# EAGLE design Adafruit-Music-Maker-MP3-Shield-RevE (EAGLE 9.6.2)
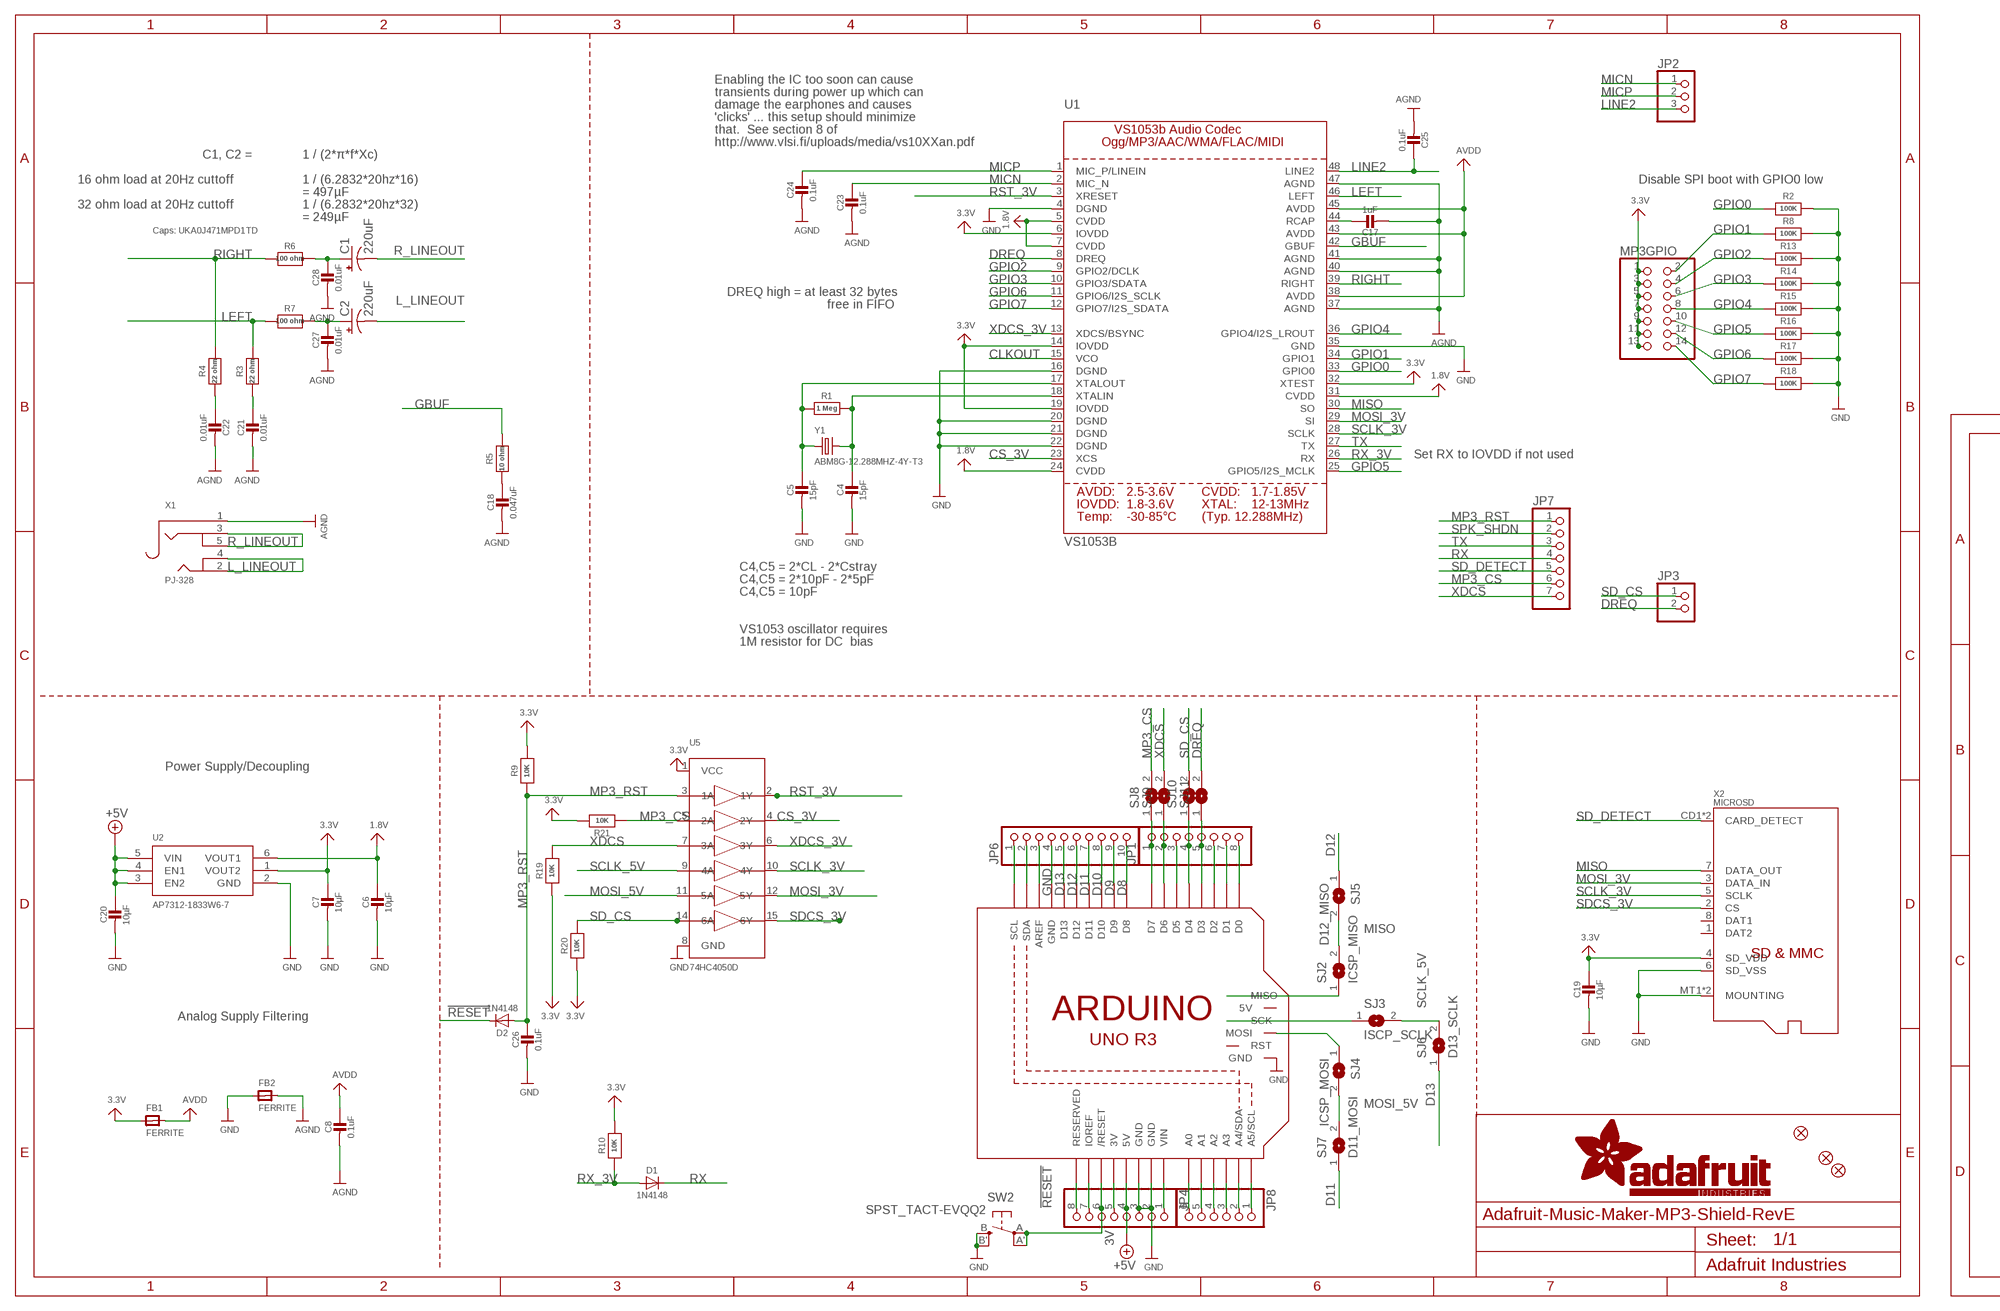
[diagram p0: schematic, sheet 1, part 1 of 2]
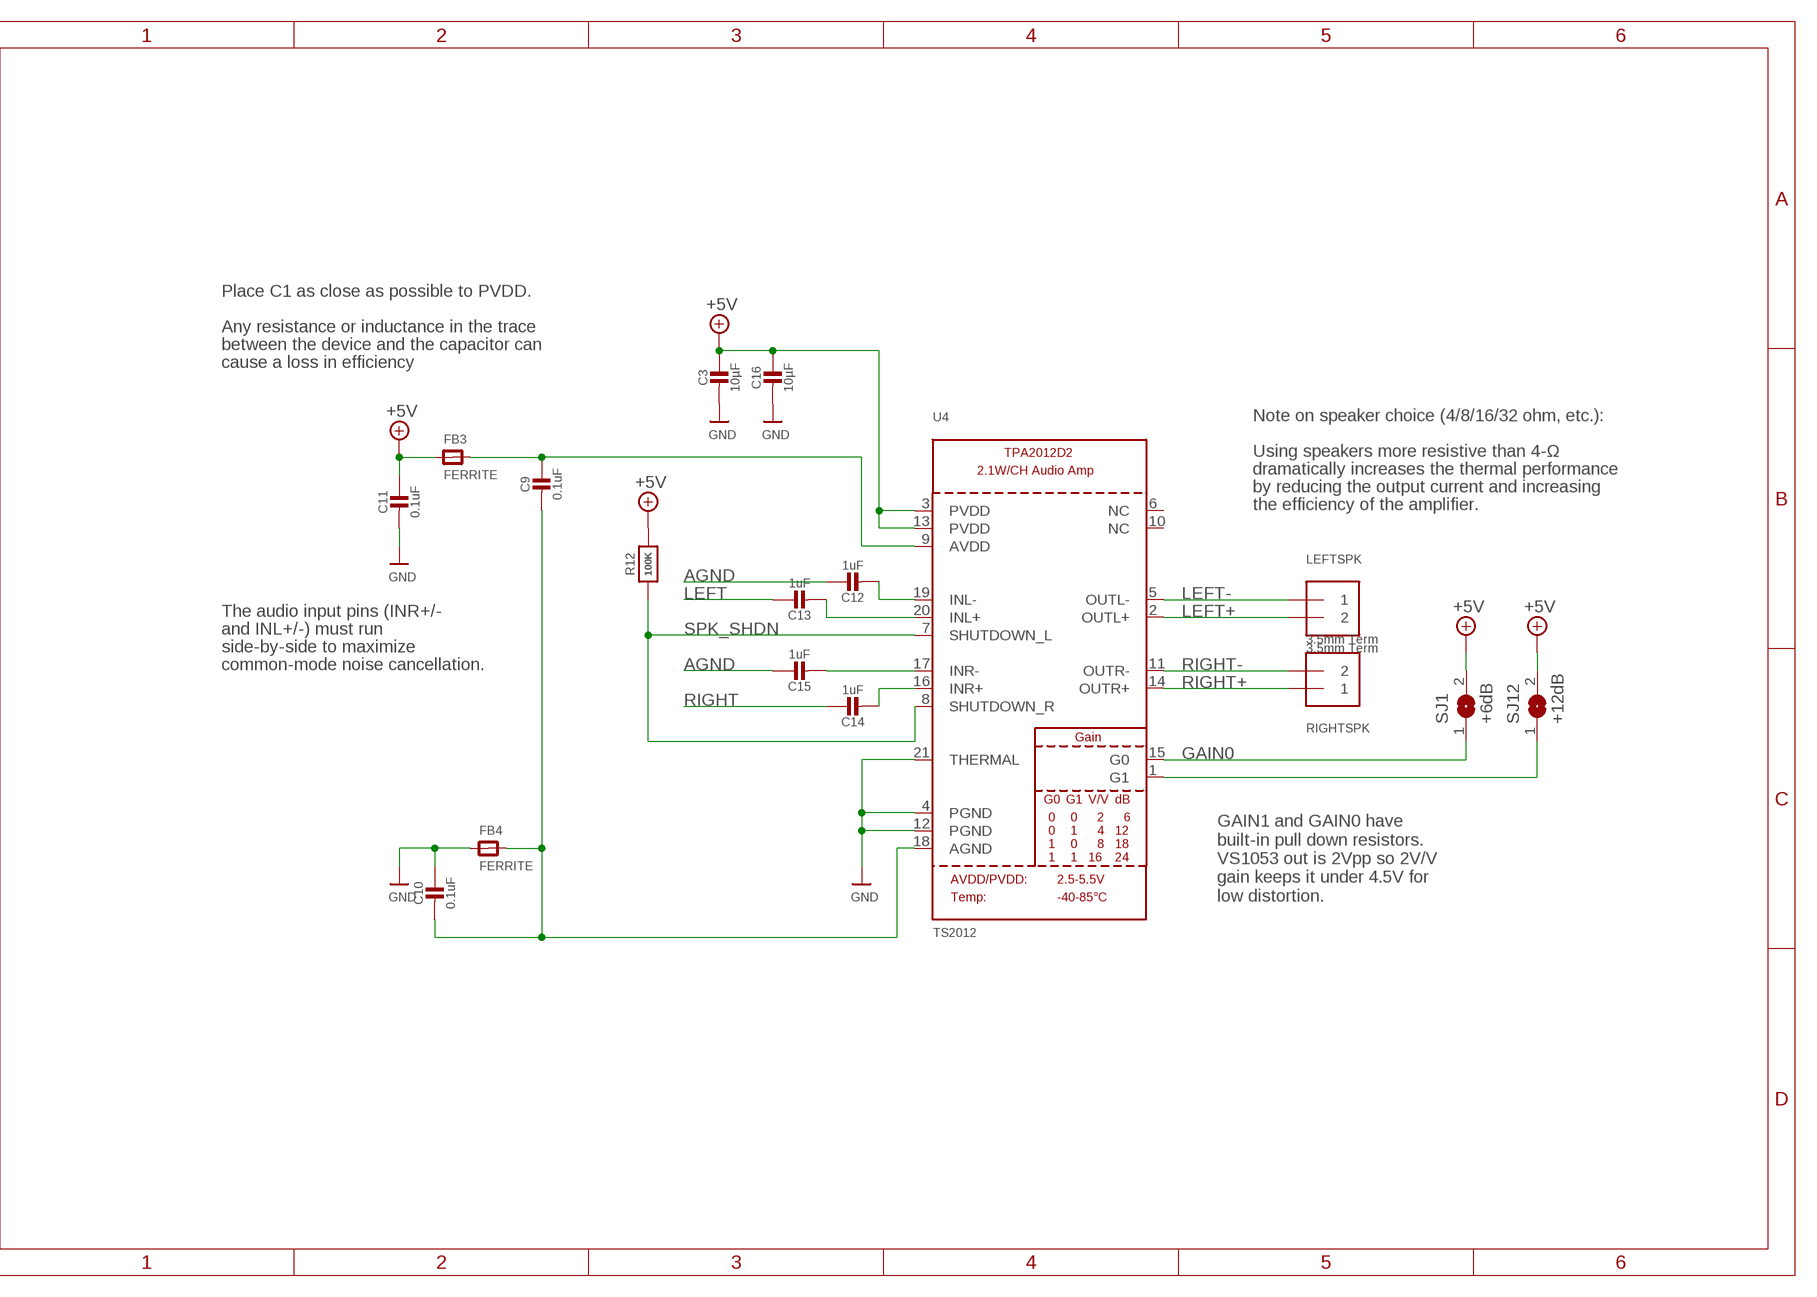
[diagram p1: schematic, sheet 1, part 2 of 2]

## Parts
C1  220uF  CPOL-USC  [PANASONIC_C]
C2  220uF  CPOL-USC  [PANASONIC_C]
C3  10µF  CAP_CERAMIC0805-NOOUTLINE  [0805-NO]
C4  15pF  CAP_CERAMIC0603_NO  [0603-NO]
C5  15pF  CAP_CERAMIC0603_NO  [0603-NO]
C6  10µF  CAP_CERAMIC0805-NOOUTLINE  [0805-NO]
C7  10µF  CAP_CERAMIC0805-NOOUTLINE  [0805-NO]
C8  0.1uF  CAP_CERAMIC0603_NO  [0603-NO]
C9  0.1uF  CAP_CERAMIC0603_NO  [0603-NO]
C10  0.1uF  CAP_CERAMIC0603_NO  [0603-NO]
C11  0.1uF  CAP_CERAMIC0603_NO  [0603-NO]
C12  1uF  CAP_CERAMIC0603_NO  [0603-NO]
C13  1uF  CAP_CERAMIC0603_NO  [0603-NO]
C14  1uF  CAP_CERAMIC0603_NO  [0603-NO]
C15  1uF  CAP_CERAMIC0603_NO  [0603-NO]
C16  10µF  CAP_CERAMIC0805-NOOUTLINE  [0805-NO]
C17  1uF  CAP_CERAMIC0603_NO  [0603-NO]
C18  0.047uF  CAP_CERAMIC0603_NO  [0603-NO]
C19  10µF  CAP_CERAMIC0805-NOOUTLINE  [0805-NO]
C20  10µF  CAP_CERAMIC0805-NOOUTLINE  [0805-NO]
C21  0.01uF  CAP_CERAMIC0603_NO  [0603-NO]
C22  0.01uF  CAP_CERAMIC0603_NO  [0603-NO]
C23  0.1uF  CAP_CERAMIC0603_NO  [0603-NO]
C24  0.1uF  CAP_CERAMIC0603_NO  [0603-NO]
C25  0.1uF  CAP_CERAMIC0603_NO  [0603-NO]
C26  0.1uF  CAP_CERAMIC0603_NO  [0603-NO]
C27  0.01uF  CAP_CERAMIC0603_NO  [0603-NO]
C28  0.01uF  CAP_CERAMIC0603_NO  [0603-NO]
D1  1N4148  DIODESOD-323  [SOD-323]
D2  1N4148  DIODESOD-323  [SOD-323]
FB1  FERRITE  FERRITE-0603NO  [0603-NO]
FB2  FERRITE  FERRITE-0603NO  [0603-NO]
FB3  FERRITE  FERRITE-0603NO  [0603-NO]
FB4  FERRITE  FERRITE-0603NO  [0603-NO]
FID1  FIDUCIAL_1MM  [FIDUCIAL_1MM]
FID2  FIDUCIAL_1MM  [FIDUCIAL_1MM]
FID3  FIDUCIAL_1MM  [FIDUCIAL_1MM]
JP1  PINHD-1X8CLEANBIG  [1X08-CLEANBIG]
JP2  PINHD-1X3CB  [1X03-CLEANBIG]
JP3  HEADER-1X2ROUND  [1X02_ROUND]
JP4  PINHD-1X8CLEANBIG  [1X08-CLEANBIG]
JP6  HEADER-1X1070MIL  [1X10_ROUND70]
JP7  HEADER-1X770MIL  [1X07_ROUND_70]
JP8  PINHD-1X6CB  [1X06-CLEANBIG]
LEFTSPK  3.5mm Term  TERMBLOCK_1X2_3.5MM  [TERMBLOCK_1X2-3.5MM]
MP3GPIO  HEADER-2X7_ROUND_70MIL  [2X07_ROUND_70MIL]
R1  1 Meg  RESISTOR_0603_NOOUT  [0603-NO]
R2  100K  RESISTOR_0603_NOOUT  [0603-NO]
R3  22 ohm  RESISTOR_0603_NOOUT  [0603-NO]
R4  22 ohm  RESISTOR_0603_NOOUT  [0603-NO]
R5  10 ohm  RESISTOR_0603_NOOUT  [0603-NO]
R6  100 ohm  RESISTOR_0603_NOOUT  [0603-NO]
R7  100 ohm  RESISTOR_0603_NOOUT  [0603-NO]
R8  100K  RESISTOR_0603_NOOUT  [0603-NO]
R9  10K  RESISTOR_0603_NOOUT  [0603-NO]
R10  10K  RESISTOR_0603_NOOUT  [0603-NO]
R12  100K  RESISTOR_0603_NOOUT  [0603-NO]
R13  100K  RESISTOR_0603_NOOUT  [0603-NO]
R14  100K  RESISTOR_0603_NOOUT  [0603-NO]
R15  100K  RESISTOR_0603_NOOUT  [0603-NO]
R16  100K  RESISTOR_0603_NOOUT  [0603-NO]
R17  100K  RESISTOR_0603_NOOUT  [0603-NO]
R18  100K  RESISTOR_0603_NOOUT  [0603-NO]
R19  10K  RESISTOR_0603_NOOUT  [0603-NO]
R20  10K  RESISTOR_0603_NOOUT  [0603-NO]
R21  10K  RESISTOR_0603_NOOUT  [0603-NO]
RIGHTSPK  3.5mm Term  TERMBLOCK_1X2_3.5MM  [TERMBLOCK_1X2-3.5MM]
SJ1  +6dB  SOLDERJUMPER  [SOLDERJUMPER_ARROW_NOPASTE]
SJ2  ICSP_MISO  SOLDERJUMPERCLOSED  [SOLDERJUMPER_CLOSEDWIRE]
SJ3  ISCP_SCLK  SOLDERJUMPERCLOSED  [SOLDERJUMPER_CLOSEDWIRE]
SJ4  ICSP_MOSI  SOLDERJUMPERCLOSED  [SOLDERJUMPER_CLOSEDWIRE]
SJ5  D12_MISO  SOLDERJUMPER  [SOLDERJUMPER_ARROW_NOPASTE]
SJ6  D13_SCLK  SOLDERJUMPER  [SOLDERJUMPER_ARROW_NOPASTE]
SJ7  D11_MOSI  SOLDERJUMPER  [SOLDERJUMPER_ARROW_NOPASTE]
SJ8  SOLDERJUMPERCLOSED  [SOLDERJUMPER_CLOSEDWIRE]
SJ9  SOLDERJUMPERCLOSED  [SOLDERJUMPER_CLOSEDWIRE]
SJ10  SOLDERJUMPERCLOSED  [SOLDERJUMPER_CLOSEDWIRE]
SJ11  SOLDERJUMPERCLOSED  [SOLDERJUMPER_CLOSEDWIRE]
SJ12  +12dB  SOLDERJUMPER  [SOLDERJUMPER_ARROW_NOPASTE]
SW2  SPST_TACT-EVQQ2  [EVQ-Q2]
U1  VS1053B  [LQFP48]
U2  AP7312-1833W6-7  VREG_SOT23-6_DUALAP7312  [SOT23-6]
U4  TS2012  AUDIOAMP_TPA2012D2  [WQFN20]
U5  74HC4050D  [SOIC16]
U$41  ARDUINO_R3_ICSP  [ARDUINOR3_ICSP]
X1  PJ-328  AUDIO_3.5MMJACK  [PJ-328-5]
X2  MICROSD  [MICROSD]
Y1  ABM8G-12.288MHZ-4Y-T3  CRYSTAL3.2X2.5  [CRYSTAL_3.2X2.5]

## Nets
1.8V: C6.1 U1.5(CVDD) U1.7(CVDD) U1.24(CVDD) U1.31(CVDD) U2.6(VOUT1)
3.3V: C7.1 C19.1 FB1.1 MP3GPIO.1 MP3GPIO.3 MP3GPIO.5 MP3GPIO.7 MP3GPIO.9 MP3GPIO.11 MP3GPIO.13 R9.2 R10.2 R19.1 R20.1 R21.2 U1.6(IOVDD) U1.14(IOVDD) U1.19(IOVDD) U1.32(XTEST) U2.1(VOUT2) U5.1(VCC) X2.4(SD_VDD)
3V: JP4.5 U$41.3V
!RESET: D2.C JP4.6 SW2.A'(P1) SW2.A(P) U$41.RESET(/RESET)
+5V: C3.1 C11.1 C16.1 C20.1 FB3.1 JP4.4 R12.2 SJ1.2 SJ12.2 U2.3(EN2) U2.4(EN1) U2.5(VIN) U4.3(PVDD) U4.13(PVDD) U$41.5V
A0: JP8.6 U$41.A0
A1: JP8.5 U$41.A1
A2: JP8.4 U$41.A2
A3: JP8.3 U$41.A3
A4: JP8.2 U$41.A4(A4/SDA)
A5: JP8.1 U$41.A5(A5/SCL)
AGND: C8.2 C12.1 C15.1 C17.2 C18.2 C21.2 C22.2 C23.2 C24.2 C25.2 C27.2 C28.2 FB2.2 U1.37(AGND) U1.40(AGND) U1.41(AGND) U1.47(AGND) X1.1
AREF: JP6.3 U$41.AREF
AVDD: C8.1 FB1.2 U1.38(AVDD) U1.43(AVDD) U1.45(AVDD)
CLKOUT: U1.15(VCO)
CS_3V: U1.23(XCS) U5.4(2Y)
D0: JP1.8 U$41.D0
D1: JP1.7 U$41.D1
D2: JP1.6 U$41.D2
D3: JP1.5 SJ11.1 U$41.D3
D4: JP1.4 SJ10.1 U$41.D4
D5: JP1.3 U$41.D5
D6: JP1.2 SJ9.1 U$41.D6
D7: JP1.1 SJ8.1 U$41.D7
D8: JP6.10 U$41.D8
D9: JP6.9 U$41.D9
D10: JP6.8 U$41.D10
D11: JP6.7 SJ7.1 U$41.D11
D12: JP6.6 SJ5.1 U$41.D12
D13: JP6.5 SJ6.1 U$41.D13
DREQ: JP3.2 SJ11.2 U1.8(DREQ)
GAIN0: SJ1.1 U4.15(G0)
GBUF: R5.1 U1.42(GBUF)
GND: C3.2 C4.2 C5.2 C6.2 C7.2 C10.1 C11.2 C16.2 C19.2 C20.2 C26.2 FB2.1 FB4.1 JP4.2 JP4.3 JP6.4 R2.2 R8.2 R13.2 R14.2 R15.2 R16.2 R17.2 R18.2 SW2.B'(S1) SW2.B(S) U1.4(DGND) U1.16(DGND) U1.20(DGND) U1.21(DGND) U1.22(DGND) U1.35(GND) U2.2(GND) U4.4(PGND) U4.12(PGND) U4.21(THERMAL) U5.8(GND) U$41.GND U$41.GND@1(GND) U$41.GND@2(GND) U$41.GND@3(GND) X2.6(SD_VSS) X2.MT1(MOUNTING) X2.MT2(MOUNTING)
GPIO0: R2.1 U1.33(GPIO0)
GPIO1: MP3GPIO.2 R8.1 U1.34(GPIO1)
GPIO2: MP3GPIO.4 R13.1 U1.9(GPIO2/DCLK)
GPIO3: MP3GPIO.6 R14.1 U1.10(GPIO3/SDATA)
GPIO4: MP3GPIO.8 R15.1 U1.36(GPIO4/I2S_LROUT)
GPIO5: MP3GPIO.10 R16.1 U1.25(GPIO5/I2S_MCLK)
GPIO6: MP3GPIO.12 R17.1 U1.11(GPIO6/I2S_SCLK)
GPIO7: MP3GPIO.14 R18.1 U1.12(GPIO7/I2S_SDATA)
IOREF: JP4.7 U$41.IOREF
L_LINEOUT: C2.- X1.2 X1.4
LEFT: C13.1 R3.1 R7.2 U1.46(LEFT)
LEFT+: LEFTSPK.2 U4.2(OUTL+)
LEFT-: LEFTSPK.1 U4.5(OUTL-)
LEFT_FILTERED: C2.+ C27.1 R7.1
LINE2: C25.1 JP2.3 U1.48(LINE2)
MICN: C23.1 JP2.1 U1.2(MIC_N)
MICP: C24.1 JP2.2 U1.1(MIC_P/LINEIN)
MISO: SJ2.2 SJ5.2 U1.30(SO) X2.7(DATA_OUT)
MISO_ICSP: SJ2.1 U$41.MISO
MOSI_3V: U1.29(SI) U5.12(5Y) X2.3(DATA_IN)
MOSI_5V: SJ4.2 SJ7.2 U5.11(5A)
MOSI_ICSP: SJ4.1 U$41.MOSI
MP3_CS: JP7.6 R21.1 SJ8.2 U5.5(2A)
MP3_RST: C26.1 D2.A JP7.1 R9.1 U5.3(1A)
N$1: C5.1 R1.1 U1.17(XTALOUT) Y1.1
N$2: C4.1 R1.2 U1.18(XTALIN) Y1.2
N$5: C21.1 R3.2
N$6: C22.1 R4.2
N$8: C13.2 U4.20(INL+)
N$9: C12.2 U4.19(INL-)
N$10: C15.2 U4.17(INR-)
N$11: C14.2 U4.16(INR+)
N$12: C9.2 C10.2 FB4.2 U4.18(AGND)
N$14: C9.1 FB3.2 U4.9(AVDD)
N$26: SJ12.1 U4.1(G1)
N$27: C17.1 U1.44(RCAP)
N$31: C18.1 R5.2
NC: JP4.8 U$41.RESERVED
R_LINEOUT: C1.- X1.3 X1.5
RIGHT: C14.1 R4.1 R6.2 U1.39(RIGHT)
RIGHT+: RIGHTSPK.1 U4.14(OUTR+)
RIGHT-: RIGHTSPK.2 U4.11(OUTR-)
RIGHT_FILTERED: C1.+ C28.1 R6.1
RST_3V: U1.3(XRESET) U5.2(1Y)
RX: D1.C JP7.4
RX_3V: D1.A R10.1 U1.26(RX)
SCK_ICSP: SJ3.1 U$41.SCK
SCL: JP6.1 U$41.SCL
SCLK_3V: U1.28(SCLK) U5.10(4Y) X2.5(SCLK)
SCLK_5V: SJ3.2 SJ6.2 U5.9(4A)
SD_CS: JP3.1 R20.2 SJ10.2 U5.14(6A)
SD_DETECT: JP7.5 X2.CD1(CARD_DETECT) X2.CD2(CARD_DETECT)
SDA: JP6.2 U$41.SDA
SDCS_3V: U5.15(6Y) X2.2(CS)
SPK_SHDN: JP7.2 R12.1 U4.7(SHUTDOWN_L) U4.8(SHUTDOWN_R)
TX: JP7.3 U1.27(TX)
VIN: JP4.1 U$41.VIN
XDCS: JP7.7 R19.2 SJ9.2 U5.7(3A)
XDCS_3V: U1.13(XDCS/BSYNC) U5.6(3Y)
Unconnected: U4.6(NC) U4.10(NC) U$41.5V_ICSP(5V) U$41.RESET_ICSP(RST) X2.1(DAT2) X2.8(DAT1)

## Notes on the sheet
- Enabling the IC too soon can cause
- transients during power up which can
- damage the earphones and causes
- 'clicks' ... this setup should minimize
- that.  See section 8 of
- http://www.vlsi.fi/uploads/media/vs10XXan.pdf
- C1, C2 = | 1 / (2*π*f*Xc)
- 16 ohm load at 20Hz cuttoff | 1 / (6.2832*20hz*16) | Disable SPI boot with GPIO0 low
- = 497µF
- 32 ohm load at 20Hz cuttoff | 1 / (6.2832*20hz*32)
- = 249µF
- Caps: UKA0J471MPD1TD
- DREQ high = at least 32 bytes
- free in FIFO
- Set RX to IOVDD if not used
- C4,C5 = 2*CL - 2*Cstray
- C4,C5 = 2*10pF - 2*5pF
- C4,C5 = 10pF
- Place C1 as close as possible to PVDD.
- VS1053 oscillator requires | Any resistance or inductance in the trace
- 1M resistor for DC  bias | between the device and the capacitor can
- cause a loss in efficiency
- Note on speaker choice (4/8/16/32 ohm, etc.):
- Using speakers more resistive than 4-Ω
- dramatically increases the thermal performance
- by reducing the output current and increasing
- the efficiency of the amplifier.
- Power Supply/Decoupling
- The audio input pins (INR+/-
- and INL+/-) must run
- side-by-side to maximize
- common-mode noise cancellation.
- Analog Supply Filtering
- GAIN1 and GAIN0 have
  built-in pull down resistors.
  VS1053 out is 2Vpp so 2V/V
  gain keeps it under 4.5V for
  low distortion.

## Library data of the parts
C1 C2 = rcl:CPOL-US: POLARIZED CAPACITOR, American symbol; SPICEPREFIX: C
C3-C28 = microbuilder:CAP_CERAMIC: Ceramic Capacitors For new designs, use the packages preceded by an '_' character since they are more reliable: The following footprints should be used on most boards: _0402 - Standard footprint for regular board layouts _0603 - Standard footprint for regular board layouts _0805 - Standard footprint for regular board layouts _1206 - Standard footprint for regular board layouts For extremely tight-pitch boards where space is at a premium, the following 'micro-pitch' footprints can be used (smaller pads, no silkscreen outline, etc.): _0402MP - Micro-pitch footprint for very dense/compact boards _0603MP - Micro-pitch footprint for very dense/compact boards _0805MP - Micro-pitch footprint for very dense/compact boards _1206MP - Micro-pitch footprint for very dense/compact boards
D1 D2 = microbuilder:DIODE: Diode SMA Model Volts Amps Type Vf Ir Digikey # Notes SSA34-E3 40V 3A Schottky 480mV @ 3A 200uA @ 40V SSA34-E3/61TGITR-ND CDBA120-G 20V 1A Schottky 500mV @ 1A 500uA @ 20V 641-1014-6-ND REEL MBRA210 10V 2A Schottky 350mV @ 2A 700uA @ 10V MBRA210LT3 SOD-123 Model Volts Amps Type Vf Ir Order # Notes BAT54T1G 30V 200mA Schottky 800mV @ 200mA 2uA @ 25V BAT54T1GOSTR-ND B0530W 30V 500mA Schottky 430mV @ 500mA 130uA @ 30V B0530W-FDICT-ND REEL MBR120 20V 1A Schottky 340mV @ 1A MBR120VLSFT1GOSCT-ND SOD-323 Model Volts Amps Type Vf Ir Order # Notes PMEG2005EJ 20V 500mA Schottky 355mV @ 500mA 568-4110-1-ND ZLLS410 10V 570mA Schottky 380mV @ 570mA ZLLS410CT-ND 1N4148WS 75V 150mA Silicon/Simple 1V 1N4148WSFSCT-ND REEL SOD-523 Model Volts Amps Type Vf Ir Order # Notes BAT54XV2 30V 200mA Schottky 0.8V @ 100mA BAT54XV2CT-ND TB751S 30V 30mA Schottky RB751S-40TE61CT-ND SOT23-R/W (R = Solder Paste/Reflow Ovens, W = Hand-Soldering) Model Volts Amps Type Vf Ir Order # Notes BAT54FILM 40V 300mA Schottky 497-7162-1-ND POWERDI-5 Model Volts Amps Type Vf Ir Order # Notes PDS560 60V 5A Schottky 670mV @ 5A 150uA @ 60V PDS560DICT-ND
FB1-FB4 = microbuilder:FERRITE: Ferrite Bead 0603 MMZ1608B121C - 120 Ohm @ 100MHz, 600mA, 0.15 Ohm DC Resistance - Digikey: 445-2164-1-ND BK1608HW121-T - 120 Ohm, 600mA Ferrite Chip - Digikey: 587-1876-2-ND 0805 HZ0805B272R-10 - 2.7K Ohm @ 100MHz, 200mA, 0.8 Ohm DC Resistance - Digikey: 240-2504-1-ND (see also Murata BLM21BD272SN1L) MMZ2012Y152B - 1.5K Ohm @ 100MHz, 500mA, 0.4 Ohm DC Resistance - Digikey: 445-1560-1-ND - Mainly for high frequency (80-400MHz) MMZ2012R102A - 1K Ohm @ 100MHz, 500mA, 0.3 Ohm DC Resistance - Digikey: 445-1555-2-ND - More general purpose (10-200MHz)
FID1-FID3 = microbuilder:FIDUCIAL: Fiducial Alignment Points Various fiducial points for machine vision alignment.; BOM: EXCLUDE
JP1 JP4 = adafruit:PINHD-1X8: PIN HEADER
JP2 = adafruit:PINHD-1X3: PIN HEADER
JP3 = microbuilder:HEADER-1X2: PIN HEADER
JP6 = microbuilder:HEADER-1X10: PIN HEADER
JP7 = microbuilder:HEADER-1X7: PIN HEADER
JP8 = adafruit:PINHD-1X6: PIN HEADER
LEFTSPK RIGHTSPK = adafruit_electromech:TERMBLOCK_1X2: 3.5mm Terminal block http://www.ladyada.net/library/pcb/eaglelibrary.html
MP3GPIO = microbuilder:HEADER-2X7: PIN HEADER
R1-R10 R12-R21 = microbuilder:RESISTOR: Resistors For new designs, use the packages preceded by an '_' character since they are more reliable: The following footprints should be used on most boards: _0402 - Standard footprint for regular board layouts _0603 - Standard footprint for regular board layouts _0805 - Standard footprint for regular board layouts _1206 - Standard footprint for regular board layouts For extremely tight-pitch boards where space is at a premium, the following 'micro-pitch' footprints can be used (smaller pads, no silkscreen outline, etc.): _0402MP - Micro-pitch footprint for very dense/compact boards _0603MP - Micro-pitch footprint for very dense/compact boards _0805MP - Micro-pitch footprint for very dense/compact boards _1206MP - Micro-pitch footprint for very dense/compact boards
SJ1 SJ5-SJ7 SJ12 = microbuilder:SOLDERJUMPER: SMD Solder JUMPER Solder the two pads together to create a connection, or remove the solder to break it. REFLOW - Use this footprint for solder paste and reflow ovens. WAVE - Use this footprint for hand-soldering (larger pads). CLOSED - Has a trace between the two pads to ensure it is closed by default. The trace needs to be cut to disable the jumper, and can be closed again by creating a solder bridge between the two pads.; BOM: EXCLUDE
SJ2-SJ4 SJ8-SJ11 = microbuilder:SOLDERJUMPER: SMD Solder JUMPER Solder the two pads together to create a connection, or remove the solder to break it. REFLOW - Use this footprint for solder paste and reflow ovens. WAVE - Use this footprint for hand-soldering (larger pads). CLOSED - Has a trace between the two pads to ensure it is closed by default. The trace needs to be cut to disable the jumper, and can be closed again by creating a solder bridge between the two pads.
SW2 = adafruit:SPST_TACT: SMT 6mm switch, EVQQ2 series http://www.ladyada.net/library/eagle
U1 = microbuilder:VS1053B: VS1053b Audio Codec - Ogg Vorbis/MP3/AAC/WMA/FLAC/MIDI; ROT: 270
U2 = adafruit_power:VREG_SOT23-6_DUAL: Dual Output SOT23-6 Linear Regulators Diodes Inc. AP7312 - Dual 150mA LDO Linear Regulator 0.2V dropout, 150mA output, 2-6V Input AP7312-1833W6-7 - 1.8V/3.3V SOT23-6 (Digikey: AP7312-1833W6-7DICT-ND) MIC5320 - Dual 150mA ULDO Linear Regulator Ultra-low 35mV dropout at 150mA, 2.3-5.5V Input 3.3V/1.8V SOT23-6 (Digikey: 576-1658-1-ND) 3.3V/1.5V SOT23-6 (Digikey: 576-3483-1-ND)
U4 = microbuilder:AUDIOAMP_TPA2012D2: TPA2012D2 2.1W/CH Stereo Class-D Audio Amp 2.1W/Ch into 4 Ohm at 5V 1.4W/Ch into 8 Ohm at 5V 720mW/Ch into 8 ohm at 3.6V Selectable Gain: 6, 12, 18 or 24 dB Power Supply (PVDD and AVDD): 2.5-5.5V Operating Temperature: -40 to 85°C Digikey (QFN20): 296-17692-1-ND; ROT: 90
U5 = microbuilder:74HC4050D: 6-channel level shifter 74HC4050D - 2V-6V Supply SOIC16 Digikey: 74HC4050D,653-ND Mouser: 771-74HC4050D-T TSSOP16 Digikey: 296-9215-1-ND Mouser:
U$41 = adafruit_micro:ARDUINO_R3_ICSP
X1 = adafruit_electromech:AUDIO_3.5MMJACK: 3.5MM Audio Jack These are normally connected as follows, from left-to right on the schematic symbol above: Tip: Left Audio Inner Ring: Right Audio Shell: Common/GND
X2 = adafruit_electromech:MICROSD: MicroSD/Transflash Card Holder with SPI pinout 3M: 2908-05WB-MG 4UConnector: 19656 Footprint courtesy: Adafruit Industries; JLC_ROTATION: 90; LCSC: C125617
Y1 = microbuilder:CRYSTAL: Crystals HC49UP - Surface Mount Crystal 4.0MHz 18pF +/-30ppm Surface Mount Crystal [Digikey: 535-9857-1-ND] 12.0 MHz Surface Mount Crystal [Digikey: 535-9869-6-ND] 25.0 MHz Surface Mount Crystal [Digikey: 535-9078-1-ND] 2.5 x 2.0mm - MEMs SMT Crystal 16.0 MHz 10pF 20ppm 2.5 x 2.0mm Crystal [Digikey -40-85°C: 535-10923-1-ND] 3.2 x 2.5mm - MEMs SMT Crystal 12.0 MHz 8pF 15ppm 3.2 x 2.5mm Crystal [Digikey: -10-70°C: 644-1047-1-ND -40-125°C: 644-1128-1-ND] 40~85°C cheaper: 644-1173-6-ND 16.0 MHz 8pF 15ppm 3.2 x 2.5mm Crystal [Digikey: -10-70°C: 644-1049-1-ND -40-125°C: 644-1129-2-ND]-40~85°C cheaper: 644-1175-6-ND 16.0 MHz 10pF 10ppm 3.2 x 2.5mm Crystal [Digikey: 644-1100-1-ND] 27.12 MHz 18pF 30ppm 3.2 x 2.5mm Crystal [Digikey: 887-1424-1-ND] 27.12MHz 10pF 10ppm 3.2 x 2.5mm Crystal [Digikey: 887-1329-1-ND] 4.9 x 1.8mm - MEMs SMT Crystal 32.768 KHz 12.5pF 20ppm 4.9 x 1.8mm Crystal [Digikey: SE2415CT-ND] 8.0 x 3.8mm - Surface Mount Crystal 32.768kHz 12.5pF 20ppm -40°C-85°C [Digikey: 535-9166-2-ND] Cylinder 32.768KHz Cylinder Crystal (2x6mm body) [Ex. Digikey: 300-8341-2-ND]

## Board
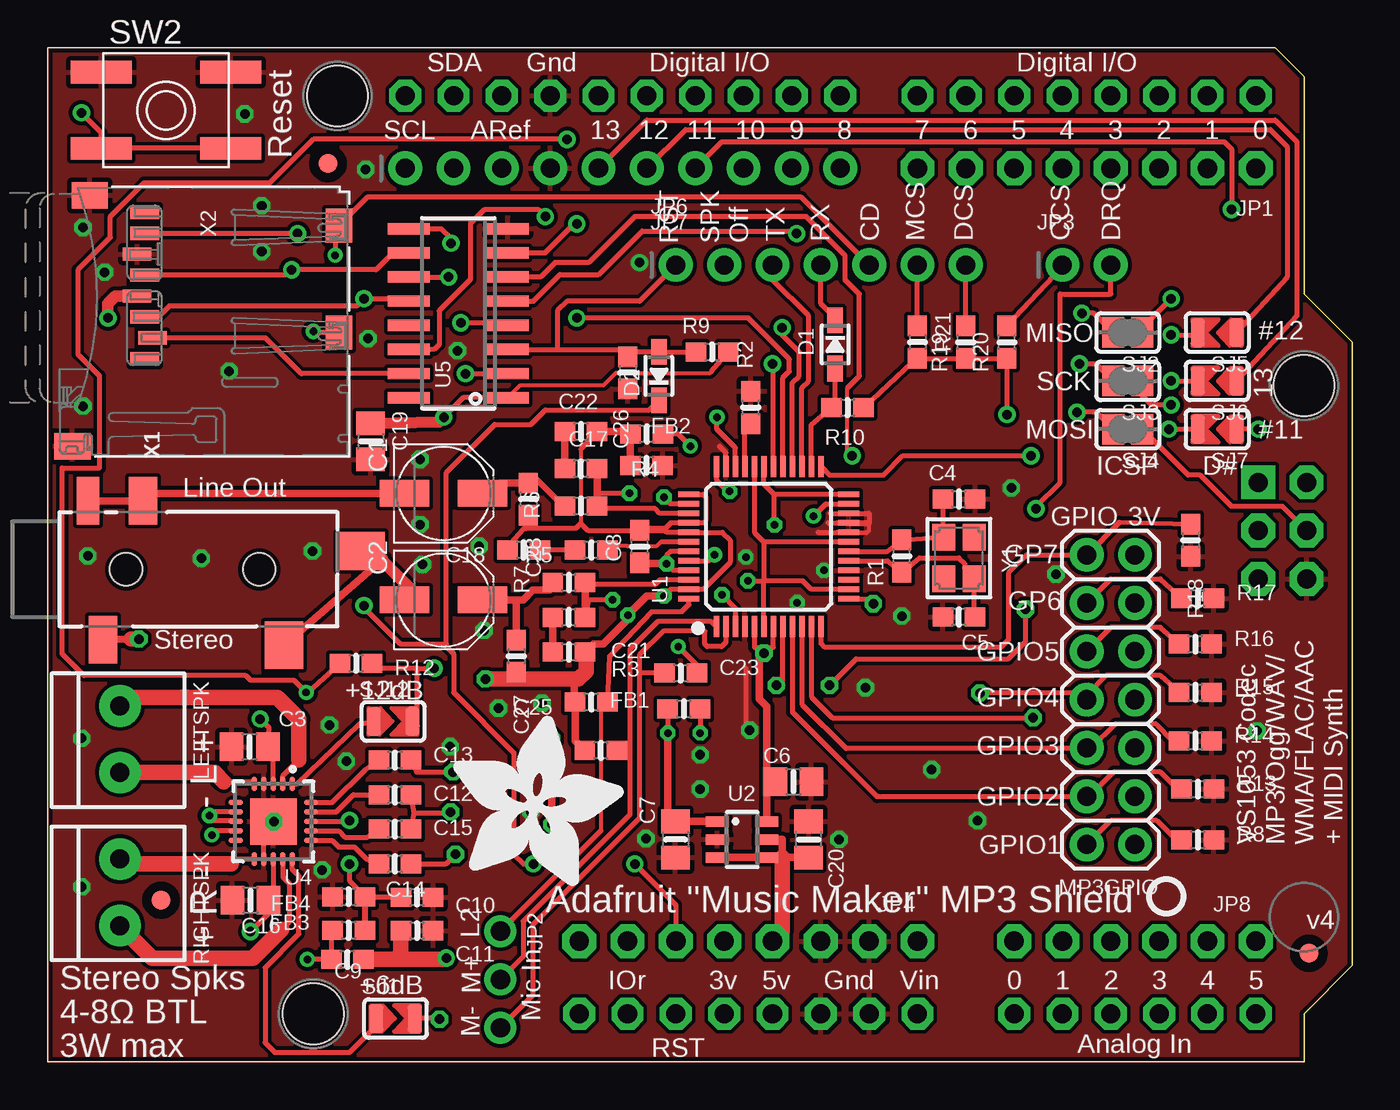
[diagram p2: board, top side]
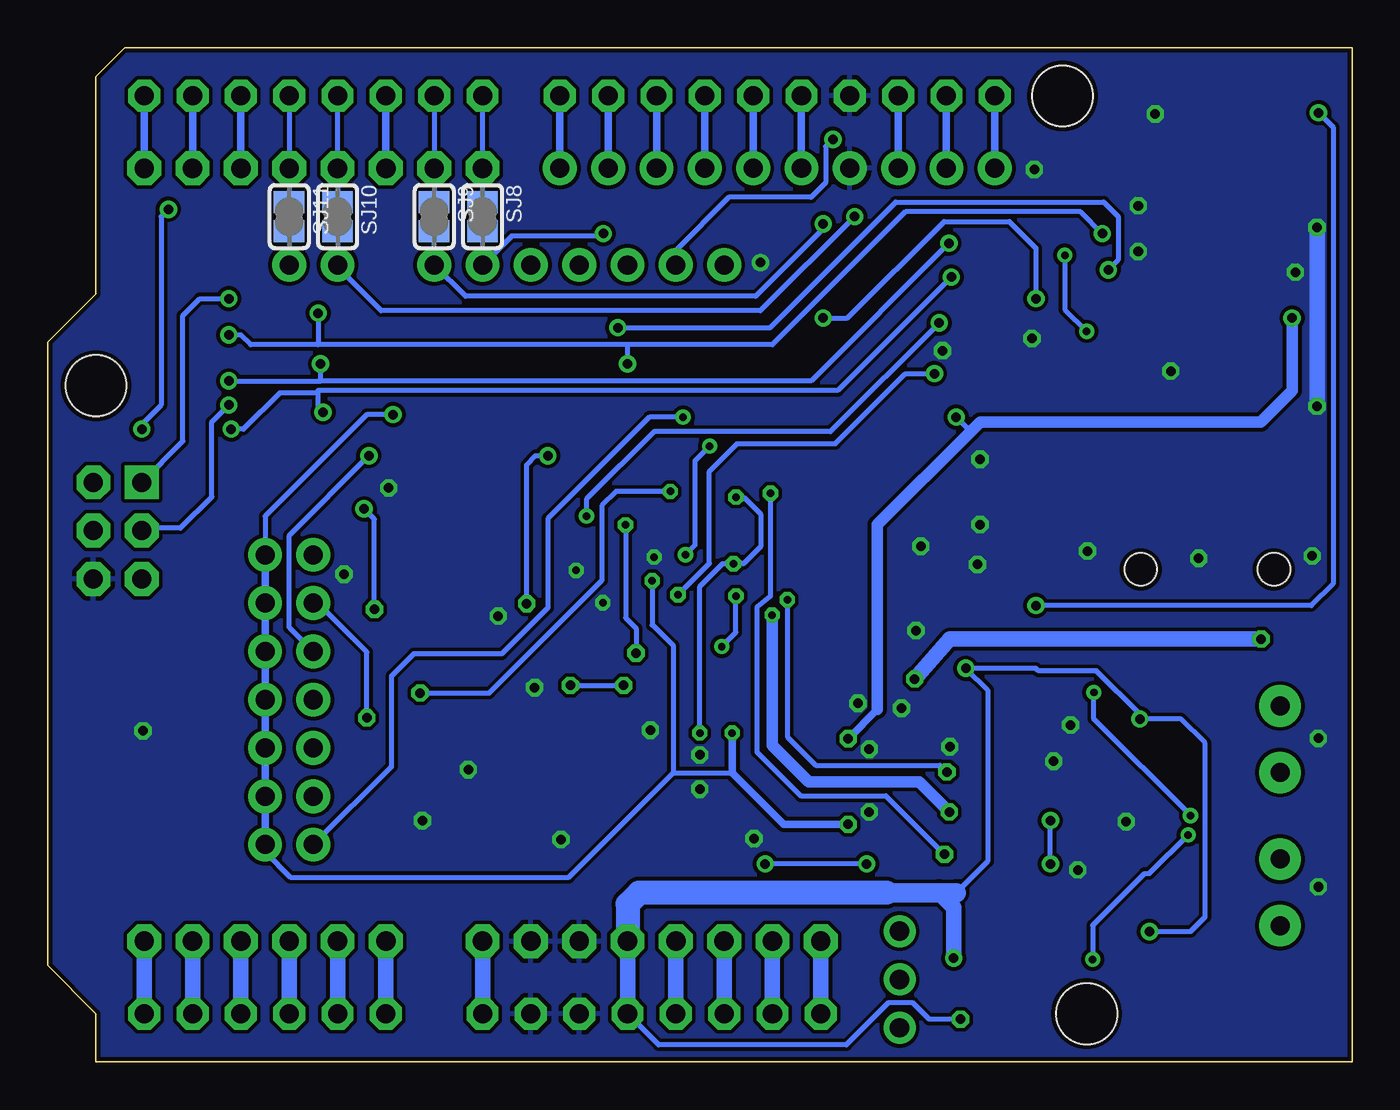
[diagram p3: board, bottom side, seen from below]

Size 68.58 x 53.34 mm. Coordinates in mm from the lower left corner, seen from the top.
Outline: 0,0 0,53.34 64.52,53.34 66.04,51.82 66.04,40.39 68.58,37.85 68.58,5.08 66.04,2.54 66.04,0 0,0
Copper layers (1*16): Top 0.035mm / dielectric 1.5mm / Bottom 0.035mm
Design rules "adafruit *": minimum track width 8mil, minimum drill 15.5mil, track to track 8mil, track to pad 8mil, pad to pad 8mil, via to via 8mil, smd to smd 8mil, copper to edge 10mil, drill to drill 8mil, minimum pad ring 10mil, minimum via ring 8mil, stop-mask expansion 2mil, vias tented up to drill 20mil, thermal gap 10mil
Holes 3.2 mm at 15.24,50.8 13.97,2.54 66.04,35.56
tRestrict: 3 lines

### Footprints (pad centres in the part's own frame; a part is rotated, then mirrored left to right if it is on the bottom)
PANASONIC_C = smd 2.6 x 1.4: + 2.05,0; - -2.05,0
0805-NO = smd 1.24 x 1.5: 1 -0.95,0; 2 0.95,0
0603-NO = smd 1.075 x 1: 1 -0.85,0; 2 0.85,0
SOD-323 = smd 1.35 x 0.8: A 1.27,0; C -1.27,0
FIDUCIAL_1MM = smd 1 x 1: 1 0,0
1X08-CLEANBIG = drill 1.016 pad 1.778 octagon: 1 -8.89,0; 2 -6.35,0; 3 -3.81,0; 4 -1.27,0; 5 1.27,0; 6 3.81,0; 7 6.35,0; 8 8.89,0
1X03-CLEANBIG = drill 1.016 pad 1.676: 1 -2.54,0; 2 0,0; 3 2.54,0
1X02_ROUND = drill 1 pad 1.778: 1 -1.27,0; 2 1.27,0
1X10_ROUND70 = drill 1 pad 1.778: 1 -11.43,0; 2 -8.89,0; 3 -6.35,0; 4 -3.81,0; 5 -1.27,0; 6 1.27,0; 7 3.81,0; 8 6.35,0; 9 8.89,0; 10 11.43,0
1X07_ROUND_70 = drill 1 pad 1.778: 1 -7.62,0; 2 -5.08,0; 3 -2.54,0; 4 0,0; 5 2.54,0; 6 5.08,0; 7 7.62,0
1X06-CLEANBIG = drill 1.016 pad 1.778 octagon: 1 -6.35,0; 2 -3.81,0; 3 -1.27,0; 4 1.27,0; 5 3.81,0; 6 6.35,0
TERMBLOCK_1X2-3.5MM = drill 1 pad 2.184: 1 1.8,0; 2 -1.7,0
2X07_ROUND_70MIL = drill 1 pad 1.778: 1 -7.62,-1.27; 2 -7.62,1.27; 3 -5.08,-1.27; 4 -5.08,1.27; 5 -2.54,-1.27; 6 -2.54,1.27; 7 0,-1.27; 8 0,1.27; 9 2.54,-1.27; 10 2.54,1.27; 11 5.08,-1.27; 12 5.08,1.27; 13 7.62,-1.27; 14 7.62,1.27
SOLDERJUMPER_ARROW_NOPASTE = smd 0.762 x 1.524: 1 -1.016,0; 2 1.016,0
SOLDERJUMPER_CLOSEDWIRE = smd 1.168 x 1.6: 1 -0.762,0; 2 0.762,0 | smd 0.635 x 0.203: WIRE 0,0
EVQ-Q2 = smd 3.2 x 1.2: A -3.4,-2; A' 3.4,-2; B -3.4,2; B' 3.4,2
LQFP48 = smd 1.1 x 0.285: 1 -4.2,2.75; 2 -4.2,2.25; 3 -4.2,1.75; 4 -4.2,1.25; 5 -4.2,0.75; 6 -4.2,0.25; 7 -4.2,-0.25; 8 -4.2,-0.75; 9 -4.2,-1.25; 10 -4.2,-1.75; 11 -4.2,-2.25; 12 -4.2,-2.75; 25 4.2,-2.75; 26 4.2,-2.25; 27 4.2,-1.75; 28 4.2,-1.25; 29 4.2,-0.75; 30 4.2,-0.25; 31 4.2,0.25; 32 4.2,0.75; 33 4.2,1.25; 34 4.2,1.75; 35 4.2,2.25; 36 4.2,2.75 | smd 0.285 x 1.1: 13 -2.75,-4.2; 14 -2.25,-4.2; 15 -1.75,-4.2; 16 -1.25,-4.2; 17 -0.75,-4.2; 18 -0.25,-4.2; 19 0.25,-4.2; 20 0.75,-4.2; 21 1.25,-4.2; 22 1.75,-4.2; 23 2.25,-4.2; 24 2.75,-4.2; 37 2.75,4.2; 38 2.25,4.2; 39 1.75,4.2; 40 1.25,4.2; 41 0.75,4.2; 42 0.25,4.2; 43 -0.25,4.2; 44 -0.75,4.2; 45 -1.25,4.2; 46 -1.75,4.2; 47 -2.25,4.2 | smd 0.28 x 1.1: 48 -2.75,4.2
SOT23-6 = smd 0.55 x 1.2: 1 -0.95,-1.3; 2 0,-1.3; 3 0.95,-1.3; 4 0.95,1.3; 5 0,1.3; 6 -0.95,1.3
WQFN20 = smd 0.28 x 0.75: 1 -1,-1.975; 2 -0.5,-1.975; 3 0,-1.975; 4 0.5,-1.975; 5 1,-1.975; 11 1,1.975; 12 0.5,1.975; 13 0,1.975; 14 -0.5,1.975; 15 -1,1.975 | smd 0.75 x 0.28: 6 1.975,-1; 7 1.975,-0.5; 8 1.975,0; 9 1.975,0.5; 10 1.975,1; 16 -1.975,1; 17 -1.975,0.5; 18 -1.975,0; 19 -1.975,-0.5; 20 -1.975,-1 | smd 2.45 x 2.45: 21 0,0
SOIC16 = smd 0.6 x 2.2: 1 -4.445,-2.6; 2 -3.175,-2.6; 3 -1.905,-2.6; 4 -0.635,-2.6; 5 0.635,-2.6; 6 1.905,-2.6; 7 3.175,-2.6; 8 4.445,-2.6; 9 4.445,2.6; 10 3.175,2.6; 11 1.905,2.6; 12 0.635,2.6; 13 -0.635,2.6; 14 -1.905,2.6; 15 -3.175,2.6; 16 -4.445,2.6
ARDUINOR3_ICSP = drill 1 pad 1.676 octagon: 3V 35.56,2.54; 5V 38.1,2.54; A0 50.8,2.54; A1 53.34,2.54; A2 55.88,2.54; A3 58.42,2.54; A4 60.96,2.54; A5 63.5,2.54; AREF 23.876,50.8; D0 63.5,50.8; D1 60.96,50.8; D2 58.42,50.8; D3 55.88,50.8; D4 53.34,50.8; D5 50.8,50.8; D6 48.26,50.8; D7 45.72,50.8; D8 41.656,50.8; D9 39.116,50.8; D10 36.576,50.8; D11 34.036,50.8; D12 31.496,50.8; D13 28.956,50.8; GND 26.416,50.8; GND@1 43.18,2.54; GND@2 40.64,2.54; IOREF 30.48,2.54; RESERVED 27.94,2.54; RESET 33.02,2.54; SCL 18.796,50.8; SDA 21.336,50.8; VIN 45.72,2.54 | drill 1 pad 1.778 octagon: 5V_ICSP 66.167,30.48; GND@3 66.167,25.4; MOSI 66.167,27.94; RESET_ICSP 63.627,25.4; SCK 63.627,27.94 | drill 1 pad 1.778 square: MISO 63.627,30.48
PJ-328-5 = smd 2.5 x 1.5: 1 -3.7,6.6; 3 3.6,4.5 | smd 2.5 x 2: 2 -4,-2.9 | smd 2 x 2.5: 4 0.95,-6.95 | smd 2.5 x 1.2: 5 3.6,7.4 | hole 1.7: 0,5.4; 0,-1.6
MICROSD = smd 0.7 x 1.5: 1 1.761,-3.147; 2 0.661,-2.747; 3 -0.439,-3.147; 4 -1.539,-3.547; 5 -2.639,-3.147; 6 -3.739,-3.547; 7 -4.839,-3.147; 8 -5.939,-3.147 | smd 1.8 x 1.4: CD1 -5.239,7.053; CD2 0.38,7.053 | smd 1.4 x 1.9: MT1 -6.839,-6.047; MT2 6.361,-6.947
CRYSTAL_3.2X2.5 = smd 1.4 x 1.2: 1 -1.1,-0.8; 2 1.1,0.8; GND1 -1.1,0.8; GND2 1.1,-0.8

### Placement (x,y rotation side)
C1  20.81,29.9 0 top
C2  20.81,24.3 0 top
C3  10.62,16.57 180 top
C4  47.9,29.6 0 top
C5  47.9,23.4 180 top
C6  39.2,14.74 0 top
C7  33,11.7 270 top
C8  31.13,27.1 90 top
C9  15.83,6.93 0 top
C10  19.42,8.66 180 top
C11  19.42,6.91 0 top
C12  18.26,14.05 180 top
C13  18.26,15.88 180 top
C14  18.26,10.42 180 top
C15  18.26,12.25 180 top
C16  10.67,8.51 180 top
C17  31.5,33.02 180 top
C18  25.02,26.92 180 top
C19  16.98,32.63 270 top
C20  40,11.7 90 top
C21  27.4,21.56 0 top
C22  28.04,33.15 0 top
C23  33.27,20.45 0 top
C24  29.08,16.38 180 top
C25  28.57,18.92 180 top
C26  30.49,36.24 270 top
C27  24.64,21.34 270 top
C28  25.27,29.59 270 top
D1  41.39,37.73 270 top
D2  32.13,36.07 90 top
FB1  33.44,18.57 0 top
FB2  31.48,31.37 180 top
FB3  15.76,5.39 180 top
FB4  15.83,8.69 0 top
FID1  5.97,8.51 0 top
FID2  66.29,5.71 0 top
FID3  14.73,47.24 0 top
JP1  54.61,46.99 0 top
JP2  23.8,4.34 90 top
JP3  54.61,41.91 0 top
JP4  36.83,6.35 180 top
JP6  30.23,46.99 0 top
JP7  40.64,41.91 0 top
JP8  57.15,6.35 180 top
LEFTSPK  3.8,17.02 270 top
MP3GPIO  55.88,19.05 90 top
R1  44.9,26.6 90 top
R2  36.96,34.42 90 top
R3  27.4,23.38 180 top
R4  28.04,31.2 180 top
R5  28.57,26.92 180 top
R6  28.04,29.24 0 top
R7  27.4,25.21 0 top
R8  60.45,11.68 0 top
R9  34.92,37.34 0 top
R10  42.05,34.41 0 top
R12  16.21,20.96 0 top
R13  60.45,14.35 0 top
R14  60.33,16.89 0 top
R15  60.33,19.43 0 top
R16  60.33,21.97 0 top
R17  60.45,24.38 0 top
R18  60.07,27.43 270 top
R19  48.26,37.85 90 top
R20  50.42,37.85 90 top
R21  45.72,37.85 270 top
RIGHTSPK  3.8,8.97 270 top
SJ1  18.29,2.29 0 top
SJ2  56.77,38.35 180 top
SJ3  56.77,35.81 180 top
SJ4  56.77,33.27 180 top
SJ5  61.47,38.35 180 top
SJ6  61.47,35.81 180 top
SJ7  61.47,33.27 180 top
SJ8  45.72,44.45 270 bottom
SJ9  48.26,44.45 270 bottom
SJ10  53.34,44.45 270 bottom
SJ11  55.88,44.45 270 bottom
SJ12  18.16,17.91 0 top
SW2  6.22,50.04 0 top
U1  37.9,27.1 90 top
U2  36.5,11.7 270 top
U4  11.87,12.64 180 top
U5  21.59,39.37 90 top
U$41  0,0 0 top
U$50  [ADAFRUIT_9MM]  21.34,9.27 0 top
U$57  [PCBFEAT-REV-040]  58.8,8.7 0 top
X1  9.53,25.91 90 top
X2  8.26,38.73 270 top
Y1  47.9,26.5 90 top

### Tracks (layer width: path | path; a pad name or v marks a point on that pad's centre or on a via)
1.8V  (via drill 0.39, 0.5)
  Top 0.254: U1.5 37.15,21.8 37.65,21.8 | 37.65,21.8 38.15,21.8 U1.7 | U1.24 38.2,29.85 | 38.2,29.85 37.65,30.4 U1.31 | v38.2,28.24 38.2,29.85 | 37.65,21.8 v37.65,21.5 37.4,21.25
  Top 0.406: 37.4,21.25 37.4,19.1 37.8,18.7 37.8,14.74 | 37.8,14.74 U2.6 | C6.1 37.8,14.74
  Bottom 0.254: v38.2,28.24 38.2,23.35 37.65,22.8 v37.65,21.5
3.3V  (via drill 0.39, 0.5)
  Top 0.203: U5.1 24.86,35.59 29.23,35.59 29.87,36.23 34.82,36.23 34.89,36.3
  Top 0.254: U1.6 37.65,25.3 | U1.19 37.65,27.35 | 37.65,27.35 37.65,25.3 | U1.32 37.15,27.85 37.65,27.35 | FB1.1 32.6,18.58 v32.6,17.3 | v36.8,25.3 37.65,25.3 | U1.14 40.15,24.85 39.7,25.3 37.65,25.3 | R10.2 45.48,36.83 R21.2 R19.1 R20.1 v50.42,34.04 | U5.1 21.84,34.92 v20.83,33.91 | 34.89,36.3 R9.2
  Top 0.406: U2.1 C7.1 32.6,12.72 v32.6,17.3 | v26.5,12.5 v26.5,17
  Top 0.61: v3.17,39.12 3.17,39.88 3.56,40.27 X2.4 | C19.1 20.57,33.65 v20.83,33.91
  Bottom 0.254: v36.8,25.3 36.8,22.96 36.74,22.96 35.7,21.91 35.7,15.2 | 35.7,15.2 32.6,15.2 | 35.7,15.2 41.18,9.72 55.82,9.72 57.15,11.05 MP3GPIO.1 | v20.83,33.91 20.07,33.15 | v50.42,34.04 51.82,34.04 57.15,28.7 MP3GPIO.13
  Bottom 0.406: MP3GPIO.13 MP3GPIO.11 MP3GPIO.9 MP3GPIO.7 MP3GPIO.5 MP3GPIO.3 MP3GPIO.1 | v26.5,12.5 29.9,12.5 32.6,15.2 v32.6,17.3 | 24.96,18.54 v26.5,17
  Bottom 0.61: 24.96,18.54 24.96,28.25 20.07,33.15 19.56,33.66 4.83,33.66 3.17,35.31 v3.17,39.12
3V
  Bottom 0.813: JP4.5 U$41.3V
!RESET  (via drill 0.5)
  Top 0.254: SW2.A' SW2.A 2.82,48.87 v1.78,49.91 | v25.53,10.41 25.02,10.41 24.51,10.92 24.51,16.26 21.34,19.43 21.34,21.46 20.95,21.84 20.95,21.97 | v16.64,24 16.57,23.94 18.54,21.97 20.95,21.97 | 20.95,21.97 20.95,30.99 23.5,33.53 25.4,33.53 26.16,34.29 31.62,34.29 D2.C | v30.86,10.41 33.02,8.26 JP4.6
  Bottom 0.254: v1.78,49.91 1.02,49.15 1.02,25.15 2.16,24 v16.64,24 | v25.53,10.41 v30.86,10.41
  Bottom 0.813: JP4.6 U$41.RESET
+5V  (via drill 0.5)
  Top 0.254: v20.6,2.25 20.27,2.25 20.23,2.29 SJ1.2 | U4.3 11.87,16.34 C3.1 11.64,17.57 v11.18,18.03 | U4.13 11.87,8.7 C16.1 11.68,7.87 v10.67,6.86 | 19.43,20.7 v20.32,20.7 | SJ12.2 19.43,17.65 19.43,20.7 | 19.43,20.7 16.98,20.7 R12.2
  Top 0.406: U2.5 38.6,11.7 38.6,10.75 U2.4 | U2.4 U2.3 | C20.1 U2.4
  Top 0.813: 38.6,10.75 38.6,6.85 JP4.4 | FB3.1 18.29,5.39 | 18.29,5.39 20.88,5.39 v20.95,5.46 | C11.1 18.57,5.67 18.29,5.39
  Bottom 0.254: v20.6,2.25 22.25,2.25 23.1,3.1 24.4,3.1 26.6,0.9 36.46,0.9 U$41.5V | 20.83,8.9 19.18,10.55 19.18,19.56 v20.32,20.7 16.64,20.7 16.51,20.57 13.46,20.57 11.18,18.29 v11.18,18.03 9.02,18.03 7.75,16.76 7.75,7.62 8.51,6.86 v10.67,6.86
  Bottom 0.813: JP4.4 U$41.5V | 21.73,8.9 20.95,8.13 v20.95,5.46
  Bottom 1.016: 24.5,8.9 21.73,8.9 20.83,8.9
  Bottom 1.27: 24.5,8.9 37.49,8.9 38.1,8.29 JP4.4
A0
  Bottom 0.813: U$41.A0 JP8.6
A1
  Bottom 0.813: U$41.A1 JP8.5
A2
  Bottom 0.813: U$41.A2 JP8.4
A3
  Bottom 0.813: U$41.A3 JP8.3
A4
  Bottom 0.813: U$41.A4 JP8.2
A5
  Bottom 0.813: U$41.A5 JP8.1
AGND  (via drill 0.39, 0.5)
  Top 0.203: 28.04,32.22 28.04,28.32
  Top 0.254: v32.4,24.5 32.75,24.85 U1.47 34.45,24.85 35.87,26.27 35.87,27.45 35.47,27.85 U1.41 32.55,27.85 32.4,28 32.75,28.35 U1.40 34.45,28.35 34.6,28.5 34.6,29.7 34.45,29.85 U1.37 | C8.2 28.4,27.95 28.04,28.32 27.79,28.07 25.15,28.07 | 28.04,32.22 28.72,32.91 29.12,32.91 C22.2 | C15.1 19.28,13.08 | 19.28,13.08 C12.1 | v21.19,13.15 21.12,13.08 19.28,13.08 | C17.2 30.65,33.14 30.63,33.15 | C18.2 24.17,27.07 25.15,28.22 | C23.2 34.22,20.77 v33.15,21.84
  Top 0.305: 25.15,28.07 25.15,28.22 25.15,28.39 C28.2
  Top 0.406: v32.4,24.5 31.5,24.5 v30.5,23.5 30.5,23.26 29.21,21.97 28.7,21.97 C21.2 28.39,21.68 28.3,21.59 | 4.41,22.24 X1.1 | 32.4,28 31.24,28 C8.2 | FB2.2 30.63,33.15 C22.2 | 27.56,20.14 27.62,20.33 C25.2 27.73,16.89 C24.2
  Top 0.61: C27.2 24.39,20.14 v23.01,20.14
  Top 0.813: 28.3,21.59 28.3,20.54 27.9,20.14 27.56,20.14 v23.01,20.14 | v4.8,22.24 4.41,22.24
  Bottom 0.254: v33.15,21.84 32.4,22.59 v32.4,24.5
  Bottom 0.6: v21.19,13.15 22.77,14.73 28.57,14.73 | 30.5,16.7 v30.5,23.5
  Bottom 0.61: 30.5,16.7 30.5,16.66 28.57,14.73
  Bottom 0.813: v4.8,22.24 21.16,22.24 v23.01,20.14
AREF
  Bottom 0.406: U$41.AREF JP6.3
AVDD  (via drill 0.39)
  Top 0.254: U1.45 32.88,25.85 v32.53,26.2 32.53,26.63 32.75,26.85 U1.43 | FB1.2 34.39,18.34 34.3,18.3 v34.3,17.3 | U1.38 32.75,29.35 v32.4,29.7
  Top 0.406: v32.53,26.2 31.24,26.2 C8.1
  Bottom 0.254: v34.3,17.3 34.3,25 33.1,26.2 v32.53,26.2 32,26.2 31.1,27.1 31.1,28.8 32,29.7 v32.4,29.7
CS_3V  (via drill 0.39, 0.5)
  Top 0.254: U5.4 24.06,38.86 v21.72,38.86 | v40.26,28.7 40.91,29.35 U1.23
  Bottom 0.254: v21.72,38.86 27.43,33.15 36.7,33.15 40.26,29.59 v40.26,28.7
D0
  Bottom 0.406: U$41.D0 JP1.8
D1
  Bottom 0.406: U$41.D1 JP1.7
D2
  Bottom 0.406: U$41.D2 JP1.6
D3
  Bottom 0.254: U$41.D3 JP1.5 SJ11.1
D4
  Bottom 0.254: SJ10.1 JP1.4 U$41.D4
D5
  Bottom 0.406: U$41.D5 JP1.3
D6
  Bottom 0.254: U$41.D6 JP1.2 SJ9.1
D7
  Bottom 0.254: SJ8.1 JP1.1 U$41.D7
D8
  Bottom 0.406: U$41.D8 JP6.10
D9
  Bottom 0.406: U$41.D9 JP6.9
D10
  Bottom 0.406: U$41.D10 JP6.8
D11  (via drill 0.5)
  Top 0.254: JP6.7 35.43,48.39 61.85,48.39 62.23,48.01 v62.23,44.83 | v63.63,33.27 SJ7.1
  Bottom 0.254: v62.23,44.83 62.61,44.45 62.61,34.54 63.63,33.53 v63.63,33.27
  Bottom 0.406: U$41.D11 JP6.7
D12
  Top 0.254: JP6.6 33.53,49.02 64.26,49.02 65.15,48.13 65.15,41.27 SJ5.1
  Bottom 0.406: U$41.D12 JP6.6
D13
  Top 0.254: JP6.5 31.5,49.53 64.52,49.53 65.66,48.39 65.66,39.24 SJ6.1
  Bottom 0.406: U$41.D13 JP6.5
DREQ  (via drill 0.5)
  Top 0.254: v51.4,23.8 51.4,22.1 50.5,21.2 42.5,21.2 v41.1,19.8 | v38.3,19.8 38.65,19.8 U1.8 | v51.94,29.08 51.94,29.21 53.21,30.48 53.21,40.39 55.88,40.39 JP3.2
  Bottom 0.254: v41.1,19.8 v38.3,19.8 | SJ11.2 JP3.2 | v51.4,23.8 51.4,28.54 v51.94,29.08
GAIN0
  Top 0.254: U4.15 12.87,10.12 13.21,9.78 13.21,6.73 11.43,4.95 11.43,1.02 11.94,0.51 15.88,0.51 17.27,1.91 SJ1.1
GBUF
  Top 0.203: 32.3,27.35 32.23,27.35 31.99,27.11 30.5,27.11 30.48,27.12 29.79,27.12 29.59,26.92
  Top 0.254: U1.42 32.3,27.35 | 29.59,26.92 R5.1
GND  (via drill 0.39, 0.5)
  Top 0.203: U1.20 43.02,27.85 43.05,27.81 43.18,27.94 43.18,28.32
  Top 0.254: 41.13,28.85 U1.22 43.18,28.85 43.18,28.32 41.5,28.32 41.5,28.35 41.01,28.35 | 40.5,27.85 41.5,27.85 | 36.7,20.7 36.7,17.8 | U4.12 11.37,12.14 U4.21 | U1.35 35.65,32.04 35.31,32.38
  Top 0.305: U1.21 43.15,28.35 43.18,28.32
  Bottom 0.813: v1.86,34.48 v1.86,43.88
  other vias: 41.6,11.7 40.8,25.85 53,25.65 46.47,15.38 63.56,17.41 42.98,19.68 44.9,23.45 39.4,24.15 36.7,26.55 22.94,22.68 25.99,18.86 25.4,13.15 25.4,16.45 34.3,16.15 34.3,14.35 50.65,30.18 48.88,12.69 36.9,17.45 31.45,11.75 11.26,42.61 11.89,12.64 14.81,17.72 14.43,10.1 15.7,15.81 16.72,46.93 11.26,45.02 10.37,49.85 8.08,26.48 22.69,27.12 21.16,16.57 31.11,42.04 9.54,36.32 16.84,38.04 21.54,37.4 3,41.53 2.11,26.61 13.92,26.86 19.7,26.16 19.58,28.26 19.58,31.69 23.7,18.61 1.8,17.02 1.8,9.21
  pour Top: 0,0 68.58,0 68.58,53.34 0,53.34
  pour Bottom: 0,0 68.58,0 68.58,53.34 0,53.34
GPIO0
  Top 0.254: U1.33 36.65,33.16 R2.1
GPIO1  (via drill 0.39)
  Top 0.254: U1.34 36.15,32.3 35.18,33.27 v35.18,33.91 | R8.1 59.31,11.68 58.29,12.7 55.88,12.7 MP3GPIO.2
  Bottom 0.254: v35.18,33.91 36.96,33.91 42.29,28.57 42.29,23.88 44.7,21.46 49.34,21.46 50.5,20.3 50.5,15.54 MP3GPIO.2
GPIO2
  Top 0.254: U1.9 39.15,18.4 43.61,13.94 43.64,13.97 MP3GPIO.4 54.76,13.97 56.03,15.24 58.49,15.24 59.38,14.35 R13.1
GPIO3
  Top 0.254: U1.10 39.65,18.8 41.97,16.48 42,16.51 MP3GPIO.6 54.86,16.51 56.13,17.78 58.23,17.78 59.12,16.89 R14.1
GPIO4  (via drill 0.39, 0.5)
  Top 0.254: U1.36 35.15,30.6 35.75,30 v35.85,30 | v49,19.4 54.39,19.4 54.61,19.18 MP3GPIO.8 54.61,19.3 55.63,20.32 58.49,20.32 R15.1
  Bottom 0.254: v49,19.4 45.37,19.4 39.45,25.32 39.45,29.25 38.7,30 v35.85,30
GPIO5  (via drill 0.5)
  Top 0.254: U1.25 41.09,30.86 43.94,30.86 44.96,31.88 v51.69,31.88 | R16.1 58.49,22.86 55.88,22.86 MP3GPIO.10
  Bottom 0.254: MP3GPIO.10 55.85,22.83 55.87,22.83 55.87,27.69 v51.69,31.88
GPIO6  (via drill 0.5)
  Top 0.254: U1.11 40.15,19.2 41.25,18.1 v51.8,18.1 | R17.1 58.49,25.4 55.88,25.4 MP3GPIO.12
  Bottom 0.254: v51.8,18.1 51.8,21.55 54.38,24.13 MP3GPIO.12
GPIO7
  Top 0.254: U1.12 40.65,22.01 40.86,21.8 50.1,21.8 50.5,22.2 50.5,25.7 51.47,26.67 MP3GPIO.14 54.63,26.67 56.28,28.32 56.28,28.34 56.33,28.38 R18.1
IOREF
  Bottom 0.813: JP4.7 U$41.IOREF
L_LINEOUT
  Top 0.406: X1.4 17.7,26.51 X1.2
  Top 0.61: X1.4 17.29,26.66 19.4,24.55 C2.-
LEFT  (via drill 0.39, 0.5)
  Top 0.254: U1.46 32.18,25.35 31.93,25.1 28.69,25.1 R7.2 | v29.7,24.3 28.42,24.3 R3.1 | C13.1 19.39,15.25 v21.31,15.25
  Top 0.406: R3.1 R7.2
  Bottom 0.254: v29.7,24.3 29.7,17.1 28.2,15.6 21.66,15.6 v21.31,15.25
LEFT+
  Top 0.254: U4.2 12.37,15.04 13.21,15.88
  Top 0.813: 13.21,15.88 13.21,18.03 12.06,19.18 4.25,19.18 LEFTSPK.2
LEFT-
  Top 0.254: U4.5 10.76,14.73 9.27,14.73
  Top 0.813: 9.27,14.73 8.78,15.22 LEFTSPK.1
LEFT_FILTERED
  Top 0.406: R7.1 26.38,24.81 25.5,24.81 24.99,24.3 24.64,24.3 | 24.64,24.3 C2.+ | C27.1 24.64,24.3
LINE2
  Top 0.203: C25.1 29.08,18.58 29.08,12.16
  Top 0.254: C25.1 29.52,21.32 31.73,23.66 33.31,23.66 33.7,24.05 U1.48 | 29.08,12.16 JP2.3
MICN
  Top 0.254: 31.1,20.45 31.1,21.39 32.37,22.66 34.54,22.66 34.54,21.97 34.67,21.84 35.43,21.84 35.65,22.06 U1.2 | 31.1,20.45 31.1,12.8 25.5,7.2 25.5,3.5 JP2.1 | C23.1 31.1,20.45
MICP
  Top 0.254: 30.6,16.38 30.6,21.69 32.07,23.16 34.89,23.16 U1.1 | 30.6,16.38 30.6,13 25,7.4 25,5.54 JP2.2 | C24.1 30.6,16.38
MISO  (via drill 0.5)
  Top 0.254: v59.05,38.23 60.45,38.23 60.58,38.35 SJ5.2 | U1.30 38.15,36.65 v38.1,36.7 | SJ2.2 54.99,39.37 v54.36,39.37 | X2.7 13.13,43.57 v13.14,43.56
  Bottom 0.254: v13.14,43.56 14.29,44.7 23.5,44.7 30.48,37.72 38.1,37.72 | 38.1,37.72 54.36,37.72 | 54.36,37.72 57.91,37.72 58.42,38.23 v59.05,38.23 | v38.1,36.7 38.1,37.72 | v54.36,39.37 54.36,37.72
MISO_ICSP  (via drill 0.5)
  Top 0.254: v59.05,40.13 57.53,38.61 SJ2.1
  Bottom 0.254: U$41.MISO 61.47,32.64 61.47,39.24 60.58,40.13 v59.05,40.13
MOSI_3V  (via drill 0.5)
  Top 0.254: U5.12 18.86,40.13 v16.64,40.13 16.26,39.75 6.38,39.75 5.81,39.17 X2.3 | U1.29 38.65,35.98 38.99,36.32 38.99,36.96 36.83,39.12 v27.81,39.12
  Bottom 0.254: v27.81,39.12 26.54,39.12 21.46,44.2 18.03,44.2 16.64,42.8 v16.64,40.13
MOSI_5V  (via drill 0.5)
  Top 0.254: U5.11 v21.08,41.27 | v58.93,33.27 SJ7.2 | SJ4.2 55.12,34.16 v54.1,34.16
  Bottom 0.254: v21.08,41.27 27.05,35.31 54.36,35.31 54.36,35.18 | 54.36,35.18 56.39,35.18 58.29,33.27 v58.93,33.27 | v54.1,34.16 54.36,34.42 54.36,35.18
MOSI_ICSP
  Top 0.254: U$41.MOSI 64.9,29.21 62.23,29.21 60.58,30.86 59.94,30.86 SJ4.1
MP3_CS  (via drill 0.5)
  Top 0.254: U5.5 25.53,40.01 26.92,41.4 28.96,41.4 31.24,43.69 39.24,43.69 v39.37,43.56 | R21.1 JP7.6
  Bottom 0.254: SJ8.2 JP7.6 44.2,43.43 39.5,43.43 v39.37,43.56
MP3_RST
  Top 0.254: U5.3 26.8,37.47 | 26.8,37.47 30.28,37.47 C26.1 30.74,37.34 D2.A R9.1 | JP7.1 31.11,40.01 27.3,40.01 26.8,39.5 26.8,37.47
N$1
  Top 0.254: U1.17 44.13,26.35 R1.1 45.82,26.5 47.9,26.5 48.2,26.2 48.2,26 48.7,25.5 Y1.1 48.7,23.62 C5.1
N$2
  Top 0.254: U1.18 44.13,26.85 R1.2 47.08,27.62 | 47.08,27.62 Y1.2 | 47.08,27.62 47.08,29.6 C4.1
N$5
  Top 0.406: R3.2 C21.1
N$6
  Top 0.406: R4.2 C22.1
N$8
  Top 0.254: U4.20 14.96,13.64 16.69,15.37 C13.2
N$9
  Top 0.254: U4.19 15.16,13.14 16.07,14.05 C12.2
N$10
  Top 0.254: U4.17 15.29,12.14 15.62,11.81 16.81,11.81 C15.2
N$11
  Top 0.254: U4.16 14.96,11.64 15.3,11.3 16.13,11.3 16.76,10.68 C14.2
N$12  (via drill 0.5)
  Top 0.254: U4.18 15.82,12.64 arc90 v15.88,12.7 | v15.88,10.41 15.88,9.53 16.66,8.74 16.68,8.62 | C10.2 17.21,8.66
  Top 0.305: C9.2 16.68,8.62 FB4.2 16.7,8.66 17.21,8.66
  Bottom 0.254: v15.88,10.41 v15.88,12.7
N$14  (via drill 0.39)
  Top 0.254: U4.9 8.84,12.14 v8.64,11.94 | v13.65,5.4 13.66,5.39 FB3.2 14.92,5.4 14.92,6.93 C9.1
  Bottom 0.254: v8.64,11.94 10.67,9.91 10.92,9.91 13.65,7.18 v13.65,5.4
N$26
  Top 0.254: U4.1 13.09,14.62 16.38,17.78 SJ12.1
N$27  (via drill 0.39)
  Top 0.254: U1.44 34.73,26.35 v35.05,26.67 | v33.78,32.38 33.15,33.02 C17.1
  Bottom 0.254: v35.05,26.67 34.54,27.18 34.54,31.62 v33.78,32.38
N$31
  Top 0.254: R5.2 C18.1
NC
  Bottom 0.813: JP4.8 U$41.RESERVED
R_LINEOUT
  Top 0.406: X1.5 X1.3 5.42,29.9 C1.-
RIGHT  (via drill 0.39, 0.5)
  Top 0.254: U1.39 32.18,28.85 31.93,29.1 29.03,29.1 R6.2 | v30.59,29.9 28.89,29.9 R4.1 | C14.1 20.94,10.42 v21.44,10.92
  Top 0.406: R4.1 R6.2
  Bottom 0.254: v30.59,29.9 30.59,24.48 31.3,23.9 31.3,16.3 29,14 24.52,14 v21.44,10.92
RIGHT+
  Top 0.254: U4.14 12.37,9.73 12.7,9.4 12.7,7.37 12.32,6.99
  Top 0.813: 12.32,6.99 10.79,5.46 5.51,5.46 RIGHTSPK.1
RIGHT-
  Top 0.254: U4.11 9.9,10.67 9.65,10.41
  Top 0.61: 4.31,10.41 4.05,10.41 RIGHTSPK.2
  Top 0.813: 9.65,10.41 4.31,10.41
RIGHT_FILTERED
  Top 0.305: C28.1 25.52,30.81 26.86,29.46 26.82,29.46 R6.1
  Top 0.406: C28.1 23.75,30.44 23.24,29.9 C1.+
RST_3V  (via drill 0.39, 0.5)
  Top 0.254: v35.45,24.57 35.45,24.55 36.15,23.85 U1.3 | v21.97,36.2 U5.2
  Bottom 0.254: v35.45,24.57 33.8,26.22 33.8,31.06 32.34,32.51 27.18,32.51 23.5,36.2 v21.97,36.2
RX
  Top 0.254: D1.C 41.27,39.11 41.27,39.24 40.64,39.88 JP7.4
RX_3V
  Top 0.254: U1.26 40.15,33.53 R10.1 41.39,34.77 D1.A
SCK_ICSP  (via drill 0.5)
  Top 0.254: v59.05,34.54 58.04,34.54 57.4,35.18 57.4,35.69 SJ3.1
  Bottom 0.254: U$41.SCK 63.5,28.07 61.59,28.07 59.94,29.72 59.94,33.66 v59.05,34.54
SCL
  Bottom 0.406: U$41.SCL JP6.1
SCLK_3V  (via drill 0.5)
  Top 0.254: U1.28 39.15,35.72 39.5,36.07 39.5,37.34 38.61,38.23 v38.61,38.61 | U5.10 18.16,42.55 17.27,41.66 v12.83,41.66 12.54,41.37 X2.5
  Bottom 0.254: v38.61,38.61 30.61,38.61 24,45.21 13.08,45.21 12.32,44.45 12.32,42.16 v12.83,41.66
SCLK_5V  (via drill 0.5)
  Top 0.254: U5.9 20.7,43.81 21.21,43.31 v21.21,43.05 | v59.05,35.81 SJ6.2 | SJ3.2 55.12,36.7 v54.23,36.7
  Bottom 0.254: v21.21,43.05 28.45,35.81 54.23,35.81 | 54.23,35.81 v54.23,36.7 | v59.05,35.81 54.23,35.81
SD_CS  (via drill 0.5)
  Top 0.254: v26.16,44.45 25.78,44.83 22.99,44.83 22.23,44.07 22.23,41.15 20.57,39.5 20.57,37.72 20.32,37.47 U5.14 | R20.2 53.34,41.78 JP3.1
  Bottom 0.254: v26.16,44.45 31.11,39.5 51.05,39.5 53.34,41.78 JP3.1 SJ10.2
SD_DETECT  (via drill 0.39)
  Top 0.254: JP7.5 39.62,45.47 16.8,45.47 X2.CD1 15.11,43.78 v15.11,42.42 | X2.CD2 14.03,38.35 v13.97,38.42
  Bottom 0.254: v15.11,42.42 15.11,39.56 v13.97,38.42
SDA
  Bottom 0.406: U$41.SDA JP6.2
SDCS_3V
  Top 0.254: U5.15 13.34,36.2 11.46,38.07 X2.2
SPK_SHDN  (via drill 0.39, 0.5)
  Top 0.254: U4.7 8.57,13.14 8.51,13.08 v8.51,12.95 8.51,12.7 9.84,12.7 U4.8 | v27.3,48.51 13.97,48.51 11.68,46.23 5.08,46.23 3.3,44.45 3.3,43.37 1.59,41.66 1.59,37.21 2.73,36.07 2.73,31.24 0.76,31.24 0.76,21.46 1.91,20.32 10.41,20.32 10.67,20.07 12.95,20.07 v13.59,19.43 v13.6,19.44 13.67,19.44 R12.1
  Bottom 0.254: v8.51,12.95 13.59,18.03 v13.59,19.43 | v27.3,48.51 27.69,48.13 27.69,46.23 28.45,45.47 32.77,45.47 35.56,42.67 JP7.2
TX
  Top 0.254: U1.27 39.65,35.46 40.01,35.81 40.01,39.24 38.1,41.15 JP7.3
VIN
  Bottom 0.813: JP4.1 U$41.VIN
XDCS  (via drill 0.5)
  Top 0.254: R19.2 JP7.7 | U5.7 26.16,42.55 27.69,44.07 v27.81,44.07
  Bottom 0.254: SJ9.2 JP7.7 46.61,40.26 31.37,40.26 27.81,43.81 v27.81,44.07
XDCS_3V  (via drill 0.5)
  Top 0.203: 42.04,32.13 42.04,35.43
  Top 0.254: U1.13 43.15,24.35 v43.4,24.1 | v42.29,31.88 42.04,32.13 | 42.04,35.43 42.67,36.07 42.67,40.39 41.91,41.15 41.91,42.42 39.88,44.45 30.86,44.45 28.45,42.04 26.67,42.04 25.91,41.27 U5.6
  Bottom 0.254: v43.4,24.1 43.4,31.4 42.92,31.88 v42.29,31.88

### Text on the board
tPlace: Reset | RST | SPK / Off | TX | RX | CD | MCS | DCS | CCS | DRQ | MISO | #12 | SCK | 13 | MOSI | #11 | ICSP | D# | Line Out | GPIO | 3V | GP7 | GP6 | Stereo | GPIO5 | GPIO4 | +12dB | GPIO3 | GPIO2 | - L + | GPIO1 | VS1053 Codec / MP3/Ogg/WAV/ / WMA/FLAC/AAC / + MIDI Synth | L2 | Adafruit "Music Maker" MP3 Shield | v4 | + R - | M+ | Stereo Spks | +6dB | M- | 4-8Ω BTL | Mic In | 3W max